# Altium project PCB_Project1.PrjPCB
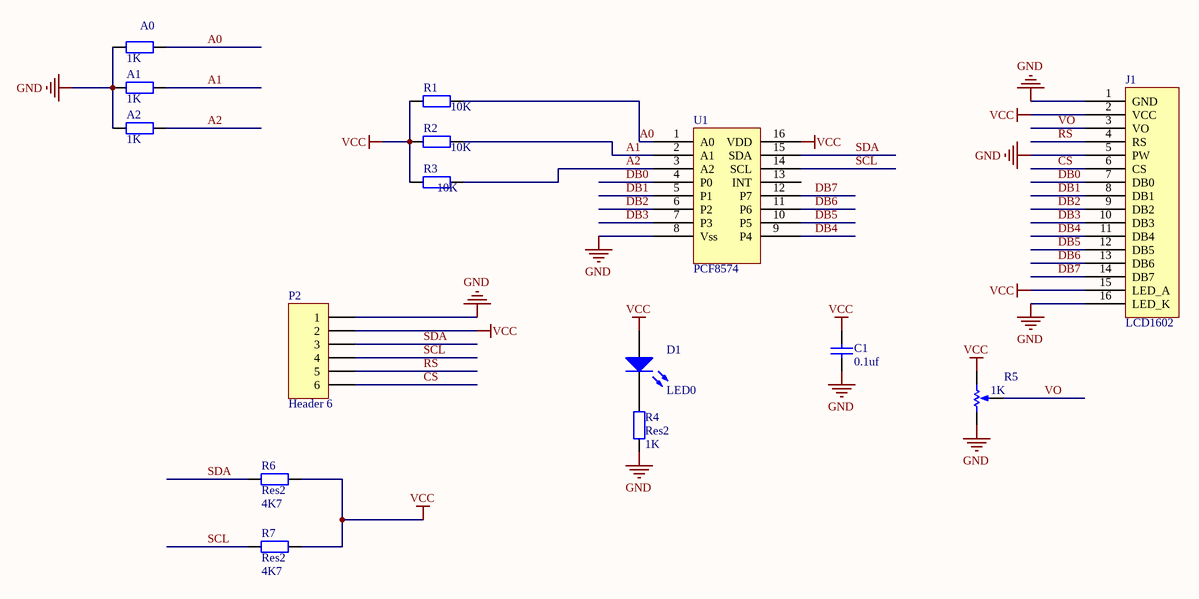
[diagram p0: Sheet1.SchDoc]
1 sheet, 15 parts. Net scope: global (net labels, ports and power ports of the same name join across sheets).
Board files: PCB1.PcbDoc, PCB2.PcbDoc, PCB3.PcbDoc

## Sheet Sheet1.SchDoc
size A4

### Parts
A0  value 1K  [C0805]  (hidden comment: Res2)
A1  value 1K  [C0805]  (hidden comment: Res2)
A2  value 1K  [C0805]  (hidden comment: Res2)
C1  value 0.1uf  [C0805]  (hidden comment: Cap Semi)
D1  LED0  [CAPR5-4X5]
J1  LCD1602  [HDR1X16]
P2  Header 6  [HDR1X6]
R1  value 10K  [C0805]  (hidden comment: Res2)
R2  value 10K  [C0805]  (hidden comment: Res2)
R3  value 10K  [C0805]  (hidden comment: Res2)
R4  Res2  value 1K  [C0805]
R5  value 1K  [HDR1X3]  (hidden comment: RPot)
R6  Res2  value 4K7  [C0805]
R7  Res2  value 4K7  [C0805]
U1  PCF8574  [PCF8574]

### Nets
GND: A0.1 A1.1 A2.1 C1.1 J1.1(GND) J1.5(PW) J1.16(LED_K) P2.1 R4.1 R5.1(TOP) U1.8(Vss)
VCC: C1.2 D1.1(A) J1.2(VCC) J1.15(LED_A) P2.2 R1.1 R2.1 R3.1 R5.2(BOT) R6.2 R7.2 U1.16(VDD)
A0: A0.2 R1.2 U1.1(A0)
A1: A1.2 R2.2 U1.2(A1)
A2: A2.2 R3.2 U1.3(A2)
CS: J1.6(CS) P2.6
DB0: J1.7(DB0) U1.4(P0)
DB1: J1.8(DB1) U1.5(P1)
DB2: J1.9(DB2) U1.6(P2)
DB3: J1.10(DB3) U1.7(P3)
DB4: J1.11(DB4) U1.9(P4)
DB5: J1.12(DB5) U1.10(P5)
DB6: J1.13(DB6) U1.11(P6)
DB7: J1.14(DB7) U1.12(P7)
RS: J1.4(RS) P2.5
SCL: P2.4 R7.1 U1.14(SCL)
SDA: P2.3 R6.1 U1.15(SDA)
VO: J1.3(VO) R5.3(TAP)
NetD1_2: D1.2(K) R4.2

Not connected (* = marked no-connect by the designer): U1 13(INT)

### Library data of the parts
A0-A2 R1-R4 R6 R7 = Res2: Resistor; Published: 8-Jun-2000; LatestRevisionDate: 17-Jul-2002; LatestRevisionNote: Re-released for DXP Platform.; PackageReference: AXIAL-0.4; Publisher: Altium Limited; PackageDescription: Axial Device, Thru-Hole; 2 Leads; 0.4 in Pin Spacing
C1 = Cap Semi: Capacitor (Semiconductor SIM Model); Published: 8-Jun-2000; LatestRevisionDate: 29-May-2009; LatestRevisionNote: IPC-7351 Footprint Added.; PackageReference: C1206; Publisher: Altium Limited; PackageDescription: Chip Capacitor
D1 = LED0: Typical INFRARED GaAs LED; Published: 8-Jun-2000; LatestRevisionDate: 08-Jul-2005; LatestRevisionNote: Mech Layer 1 removed.; PackageReference: LED-0; Publisher: Altium Limited; PackageDescription: LED; 2 Leads
J1 = Component_2
P2 = Header 6: Header, 6-Pin; LatestRevisionDate: 17-Jul-2002; LatestRevisionNote: Re-released for DXP Platform.; Publisher: Altium Limited
R5 = RPot: Potentiometer; Sim Note: Enter the Resistance value and the set point into parameter fields.; Set Position: 0.5; Published: 8-Jun-2000; LatestRevisionDate: 17-Jul-2002; LatestRevisionNote: Re-released for DXP Platform.; PackageReference: VR5; Publisher: Altium Limited; PackageDescription: Variable Resistor, Thru-Hole; 3 Leads
U1 = Component_1